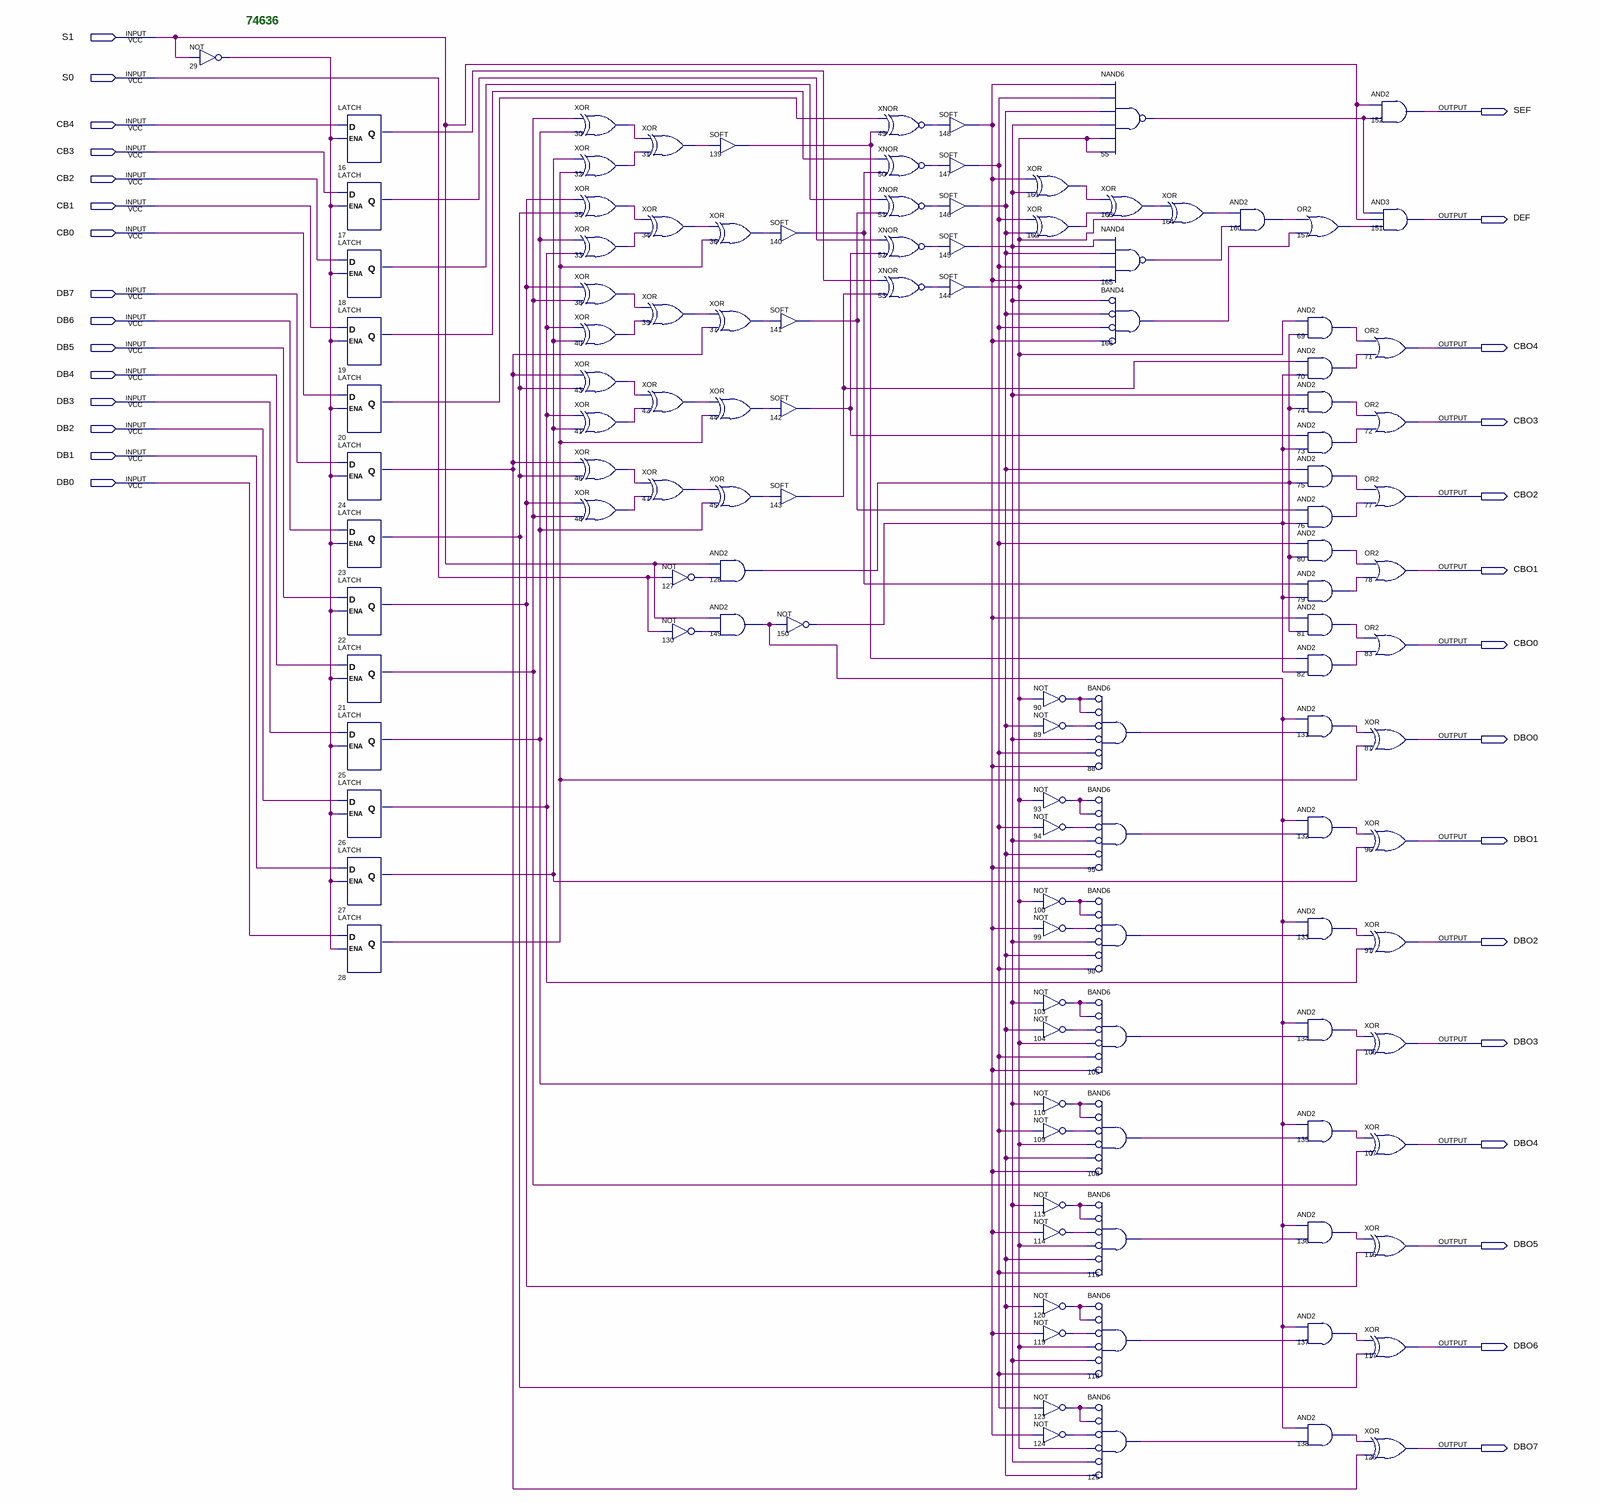
[diagram p0: schematic sheet]
// Quartus schematic 74636.bdf as structural Verilog: 119 symbols, 30 pins
module \74636  (
  input  S1,
  input  S0,
  input  CB4,
  input  CB3,
  input  CB2,
  input  CB1,
  input  CB0,
  input  DB7,
  input  DB6,
  input  DB5,
  input  DB4,
  input  DB3,
  input  DB2,
  input  DB1,
  input  DB0,
  output SEF,
  output DEF,
  output CBO4,
  output CBO3,
  output CBO2,
  output CBO1,
  output CBO0,
  output DBO0,
  output DBO1,
  output DBO2,
  output DBO3,
  output DBO4,
  output DBO5,
  output DBO6,
  output DBO7
);

  wire n16_q, n17_q, n18_q, n19_q, n20_q, n21_q, n22_q, n23_q, n24_q, n25_q, n26_q, n27_q, n28_q, n29_out,
       n30_out, n31_out, n32_out, n33_out, n34_out, n35_out, n36_out, n37_out, n38_out, n39_out, n40_out,
       n41_out, n42_out, n43_out, n44_out, n45_out, n46_out, n47_out, n48_out, n49_out, n50_out, n51_out,
       n52_out, n53_out, n55_out, n69_out, n70_out, n73_out, n74_out, n75_out, n76_out, n79_out, n80_out,
       n81_out, n82_out, n88_out, n89_out, n90_out, n93_out, n94_out, n95_out, n98_out, n99_out, n100_out,
       n103_out, n104_out, n105_out, n108_out, n109_out, n110_out, n113_out, n114_out, n115_out, n118_out,
       n119_out, n120_out, n123_out, n124_out, n125_out, n127_out, n128_out, n130_out, n131_out, n132_out,
       n133_out, n134_out, n135_out, n136_out, n137_out, n138_out, n139_out, n140_out, n141_out, n142_out,
       n143_out, n144_out, n145_out, n146_out, n147_out, n148_out, n149_out, n150_out, n157_out, n160_out,
       n161_out, n162_out, n163_out, n164_out, n165_out, n166_out;

  not u_29 (n29_out, S1);
  LATCH u_16 (.D(CB4), .ENA(n29_out), .Q(n16_q));
  LATCH u_17 (.D(CB3), .ENA(n29_out), .Q(n17_q));
  LATCH u_18 (.D(CB2), .ENA(n29_out), .Q(n18_q));
  LATCH u_19 (.D(CB1), .ENA(n29_out), .Q(n19_q));
  LATCH u_20 (.D(CB0), .ENA(n29_out), .Q(n20_q));
  LATCH u_24 (.D(DB7), .ENA(n29_out), .Q(n24_q));
  LATCH u_23 (.D(DB6), .ENA(n29_out), .Q(n23_q));
  LATCH u_22 (.D(DB5), .ENA(n29_out), .Q(n22_q));
  LATCH u_21 (.D(DB4), .ENA(n29_out), .Q(n21_q));
  LATCH u_25 (.D(DB3), .ENA(n29_out), .Q(n25_q));
  LATCH u_26 (.D(DB2), .ENA(n29_out), .Q(n26_q));
  LATCH u_27 (.D(DB1), .ENA(n29_out), .Q(n27_q));
  LATCH u_28 (.D(DB0), .ENA(n29_out), .Q(n28_q));
  xor u_30 (n30_out, n21_q, n25_q);
  xor u_32 (n32_out, n27_q, n28_q);
  xor u_35 (n35_out, n22_q, n23_q);
  xor u_33 (n33_out, n25_q, n26_q);
  xor u_38 (n38_out, n22_q, n21_q);
  xor u_40 (n40_out, n26_q, n27_q);
  xor u_43 (n43_out, n24_q, n23_q);
  xor u_41 (n41_out, n26_q, n27_q);
  xor u_46 (n46_out, n24_q, n23_q);
  xor u_48 (n48_out, n22_q, n21_q);
  xor u_31 (n31_out, n30_out, n32_out);
  xor u_34 (n34_out, n35_out, n33_out);
  xor u_39 (n39_out, n38_out, n40_out);
  xor u_42 (n42_out, n43_out, n41_out);
  xor u_47 (n47_out, n46_out, n48_out);
  not u_127 (n127_out, S0);
  not u_130 (n130_out, S0);
  SOFT u_139 (.IN(n31_out), .OUT(n139_out));
  xor u_36 (n36_out, n34_out, n28_q);
  xor u_37 (n37_out, n39_out, n24_q);
  xor u_44 (n44_out, n42_out, n28_q);
  xor u_45 (n45_out, n47_out, n25_q);
  and u_128 (n128_out, S1, n127_out);
  and u_149 (n149_out, S1, n130_out);
  SOFT u_140 (.IN(n36_out), .OUT(n140_out));
  SOFT u_141 (.IN(n37_out), .OUT(n141_out));
  SOFT u_142 (.IN(n44_out), .OUT(n142_out));
  SOFT u_143 (.IN(n45_out), .OUT(n143_out));
  not u_150 (n150_out, n149_out);
  xnor u_49 (n49_out, n20_q, n139_out);
  xnor u_50 (n50_out, n19_q, n140_out);
  xnor u_51 (n51_out, n18_q, n141_out);
  xnor u_52 (n52_out, n17_q, n142_out);
  xnor u_53 (n53_out, n16_q, n143_out);
  SOFT u_148 (.IN(n49_out), .OUT(n148_out));
  SOFT u_147 (.IN(n50_out), .OUT(n147_out));
  SOFT u_146 (.IN(n51_out), .OUT(n146_out));
  SOFT u_145 (.IN(n52_out), .OUT(n145_out));
  SOFT u_144 (.IN(n53_out), .OUT(n144_out));
  xor u_161 (n161_out, n148_out, n145_out);
  xor u_162 (n162_out, n147_out, n146_out);
  not u_90 (n90_out, n144_out);
  not u_89 (n89_out, n146_out);
  not u_93 (n93_out, n144_out);
  not u_94 (n94_out, n147_out);
  not u_100 (n100_out, n144_out);
  not u_99 (n99_out, n148_out);
  not u_103 (n103_out, n145_out);
  not u_104 (n104_out, n146_out);
  not u_110 (n110_out, n145_out);
  not u_109 (n109_out, n147_out);
  not u_113 (n113_out, n145_out);
  not u_114 (n114_out, n148_out);
  not u_120 (n120_out, n146_out);
  not u_119 (n119_out, n148_out);
  not u_123 (n123_out, n147_out);
  not u_124 (n124_out, n148_out);
  nand u_55 (n55_out, n148_out, n147_out, n146_out, n145_out, n144_out, n144_out);
  xor u_163 (n163_out, n161_out, n162_out);
  nand u_165 (n165_out, n145_out, n146_out, n147_out, n148_out);
  and u_166 (n166_out, ~n145_out, ~n146_out, ~n147_out, ~n148_out);  // BAND4
  and u_88 (n88_out, ~n90_out, ~n90_out, ~n89_out, ~n145_out, ~n147_out, ~n148_out);  // BAND6
  and u_95 (n95_out, ~n93_out, ~n93_out, ~n94_out, ~n145_out, ~n146_out, ~n148_out);  // BAND6
  and u_98 (n98_out, ~n100_out, ~n100_out, ~n99_out, ~n145_out, ~n146_out, ~n147_out);  // BAND6
  and u_105 (n105_out, ~n103_out, ~n103_out, ~n104_out, ~n144_out, ~n147_out, ~n148_out);  // BAND6
  and u_108 (n108_out, ~n110_out, ~n110_out, ~n109_out, ~n144_out, ~n146_out, ~n148_out);  // BAND6
  and u_115 (n115_out, ~n113_out, ~n113_out, ~n114_out, ~n144_out, ~n146_out, ~n147_out);  // BAND6
  and u_118 (n118_out, ~n120_out, ~n120_out, ~n119_out, ~n144_out, ~n145_out, ~n147_out);  // BAND6
  and u_125 (n125_out, ~n123_out, ~n123_out, ~n124_out, ~n144_out, ~n145_out, ~n146_out);  // BAND6
  xor u_164 (n164_out, n163_out, n144_out);
  and u_160 (n160_out, n164_out, n165_out);
  or u_157 (n157_out, n160_out, n166_out);
  and u_69 (n69_out, n144_out, n128_out);
  and u_70 (n70_out, n143_out, n150_out);
  and u_74 (n74_out, n145_out, n128_out);
  and u_73 (n73_out, n142_out, n150_out);
  and u_75 (n75_out, n146_out, n128_out);
  and u_76 (n76_out, n141_out, n150_out);
  and u_80 (n80_out, n147_out, n128_out);
  and u_79 (n79_out, n140_out, n150_out);
  and u_81 (n81_out, n148_out, n128_out);
  and u_82 (n82_out, n139_out, n150_out);
  and u_131 (n131_out, n149_out, n88_out);
  and u_132 (n132_out, n149_out, n95_out);
  and u_133 (n133_out, n149_out, n98_out);
  and u_134 (n134_out, n149_out, n105_out);
  and u_135 (n135_out, n149_out, n108_out);
  and u_136 (n136_out, n149_out, n115_out);
  and u_137 (n137_out, n149_out, n118_out);
  and u_138 (n138_out, n149_out, n125_out);
  and u_152 (SEF, S1, n55_out);
  and u_151 (DEF, n55_out, S1, n157_out);
  or u_71 (CBO4, n69_out, n70_out);
  or u_72 (CBO3, n74_out, n73_out);
  or u_77 (CBO2, n75_out, n76_out);
  or u_78 (CBO1, n80_out, n79_out);
  or u_83 (CBO0, n81_out, n82_out);
  xor u_87 (DBO0, n131_out, n28_q);
  xor u_96 (DBO1, n132_out, n27_q);
  xor u_97 (DBO2, n133_out, n26_q);
  xor u_106 (DBO3, n134_out, n25_q);
  xor u_107 (DBO4, n135_out, n21_q);
  xor u_116 (DBO5, n136_out, n22_q);
  xor u_117 (DBO6, n137_out, n23_q);
  xor u_126 (DBO7, n138_out, n24_q);

  // Notes on the sheet:
  //   74636
endmodule
